# EAGLE design 10w_Driver (EAGLE 7.2.0)
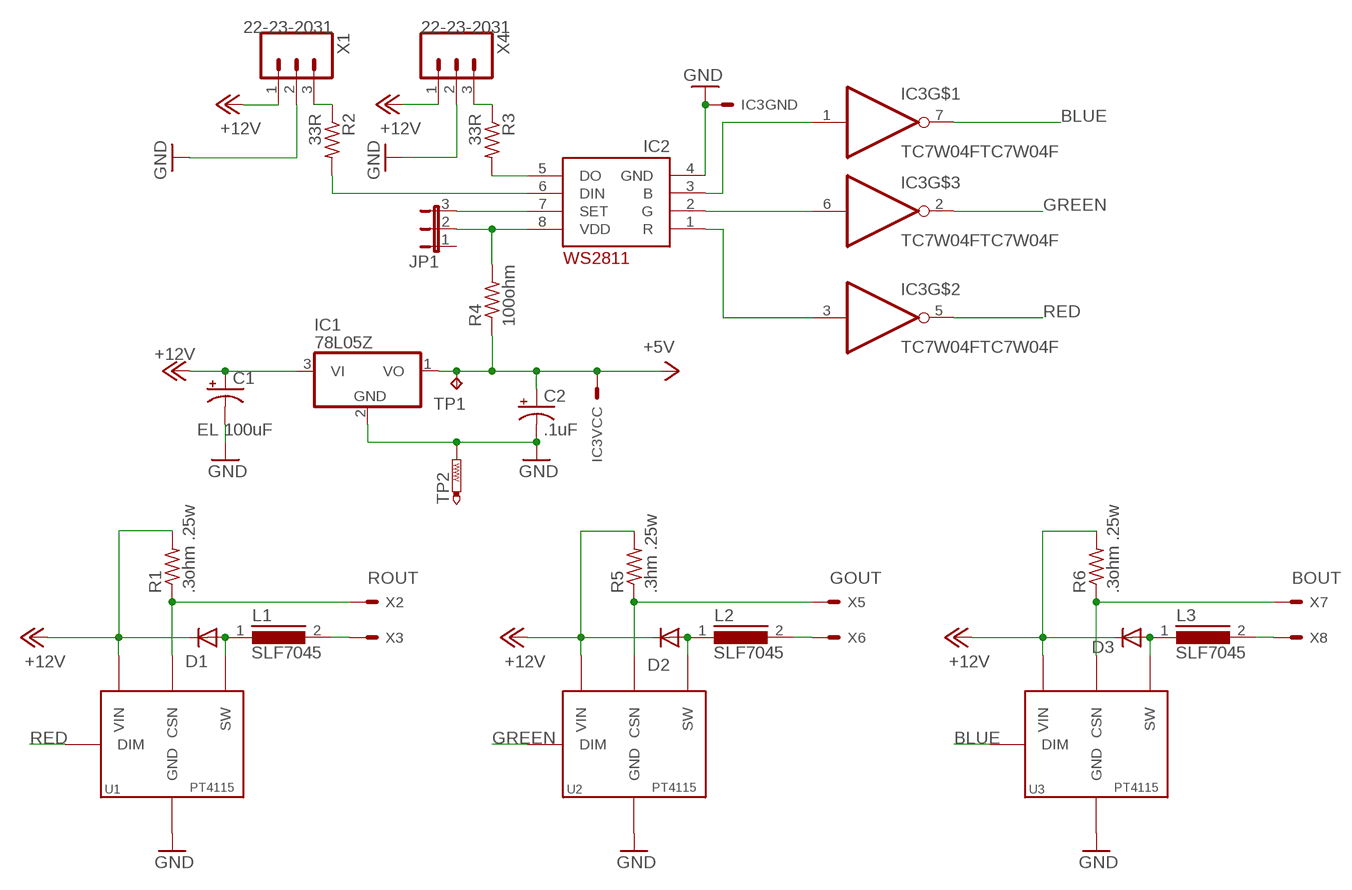
[diagram p0: schematic, sheet 1]

## Parts
C1  EL 100uF  CPOL-USTT2D6L  [TT2D6L]
C2  .1uF  CPOL-USB45181A  [B45181A]
D1  DIODE-DO07  [DO07]
D2  DIODE-DO07  [DO07]
D3  DIODE-DO07  [DO07]
IC1  78L05Z  [TO92]
IC2  WS2811-SOP8  [SO08-SKINNYPADS]
IC3  TC7W04FTC7W04F  [SO08]
JP1  JP2E  [JP2]
L1  SLF7045  [SLF7045]
L2  SLF7045  [SLF7045]
L3  SLF7045  [SLF7045]
R1  .3ohm .25w  R-US_R1206  [R1206]
R2  33R  R-US_M0805  [M0805]
R3  33R  R-US_M0805  [M0805]
R4  100ohm  R-US_M0805  [M0805]
R5  .3hm .25w  R-US_M1206  [M1206]
R6  .3ohm .25w  R-US_R1206  [R1206]
TP1  TPB2,54  [B2,54]
TP2  PTR1TP20SQ  [TP20SQ]
U1  PT4115PT4115B89E  [SOT89-5]
U2  PT4115PT4115B89E  [SOT89-5]
U3  PT4115PT4115B89E  [SOT89-5]
X1  22-23-2031  [22-23-2031]
X2  LED-PAD  [LED-PAD]
X3  LED-PAD  [LED-PAD]
X4  22-23-2031  [22-23-2031]
X5  LED-PAD  [LED-PAD]
X6  LED-PAD  [LED-PAD]
X7  LED-PAD  [LED-PAD]
X8  LED-PAD  [LED-PAD]

## Nets
+5V: C2.+ IC1.1(VO) IC3.8(VCC:S) R4.1 TP1.TP
+12V: C1.+ D1.C D2.C D3.C IC1.3(VI) R1.2 R5.2 R6.2 U1.5(VIN) U2.5(VIN) U3.5(VIN) X1.1 X4.1
BLUE: IC3.7(O) U3.3(DIM)
BOUT: R6.1 U3.4(CSN) X7.P$1@1(S) X7.P$1@2(S) X7.P$1@3(S)
GND: C1.- C2.- IC1.2(GND) IC2.4(GND) IC3.4(GND:S) TP2.TP U1.2(GND) U1.2A(GND) U1.2A@1(GND) U1.2A@2(GND) U1.2A@3(GND) U1.2A@4(GND) U2.2(GND) U2.2A(GND) U2.2A@1(GND) U2.2A@2(GND) U2.2A@3(GND) U2.2A@4(GND) U3.2(GND) U3.2A(GND) U3.2A@1(GND) U3.2A@2(GND) U3.2A@3(GND) U3.2A@4(GND) X1.2 X4.2
GOUT: R5.1 U2.4(CSN) X5.P$1@1(S) X5.P$1@2(S) X5.P$1@3(S)
GREEN: IC3.2(O) U2.3(DIM)
N$1: D1.A L1.1 U1.1(SW)
N$2: D3.A L3.1 U3.1(SW)
N$3: L1.2 X3.P$1@1(S) X3.P$1@2(S) X3.P$1@3(S)
N$4: R3.1 X4.3
N$5: D2.A L2.1 U2.1(SW)
N$6: R2.1 X1.3
N$7: IC2.5(DO) R3.2
N$8: IC2.6(DIN) R2.2
N$9: L2.2 X6.P$1@1(S) X6.P$1@2(S) X6.P$1@3(S)
N$10: L3.2 X8.P$1@1(S) X8.P$1@2(S) X8.P$1@3(S)
N$14: IC2.8(VDD) JP1.2 R4.2
N$15: IC2.1(R) IC3.3(I)
N$16: IC2.3(B) IC3.1(I)
N$18: IC2.7(SET) JP1.3
N$19: IC2.2(G) IC3.6(I)
RED: IC3.5(O) U1.3(DIM)
ROUT: R1.1 U1.4(CSN) X2.P$1@1(S) X2.P$1@2(S) X2.P$1@3(S)
Unconnected: JP1.1

## Library data of the parts
C1 = rcl:CPOL-US: POLARIZED CAPACITOR, American symbol
C2 = resistor:CPOL-US: POLARIZED CAPACITOR, American symbol
D1-D3 = diode:DIODE-: DIODE
IC1 = linear:78*: Positive VOLTAGE REGULATOR Source: http://cache.national.com/ds/LM/LM78L05.pdf http://www.fairchildsemi.com/ds/LM/LM7805.pdf
IC2 = MyLibrary:WS2811
IC3 = MyLibrary:TC7W04F
JP1 = jumper:JP2E: JUMPER
L1-L3 = inductors:SLF7045: SMD Inductors(Coils) For Power Line (Wound, Magnetic Shielded) Source: TDK, e531_slf7045.pdf
R1 R5 R6 = resistor:R-US_: RESISTOR, American symbol
R2-R4 = rcl:R-US_: RESISTOR, American symbol
TP1 = testpad:TP: Test pad
TP2 = testpad:PTR1: TEST PIN
U1-U3 = IC:PT4115: 30V, 1.2A Step-down High Brightness LED Driver with 5000:1 Dimming PDF: http://www.google.pl/url?sa=t&rct=j&q=PT4115&source=web&cd=1&ved=0CC4QFjAA&url=http%3A%2F%2Fwww.micro-bridge.com%2Fdata%2FCRpowtech%2FPT4115E.pdf&ei=9NbxUKXPJNSzhAem2oGoAQ&usg=AFQjCNEsPWIIWjIVjxpF5YN6SPR3coTTpw&bvm=bv.1357700187,d.d2k
X1 X4 = MyLibrary:22-23-2031: .100" (2.54mm) Center Header - 3 Pin; MF: MOLEX; MPN: 22-23-2031; OC_FARNELL: 1462950; OC_NEWARK: 30C0862
X2 X3 X5-X8 = MyLibrary:LED-PAD

## Board
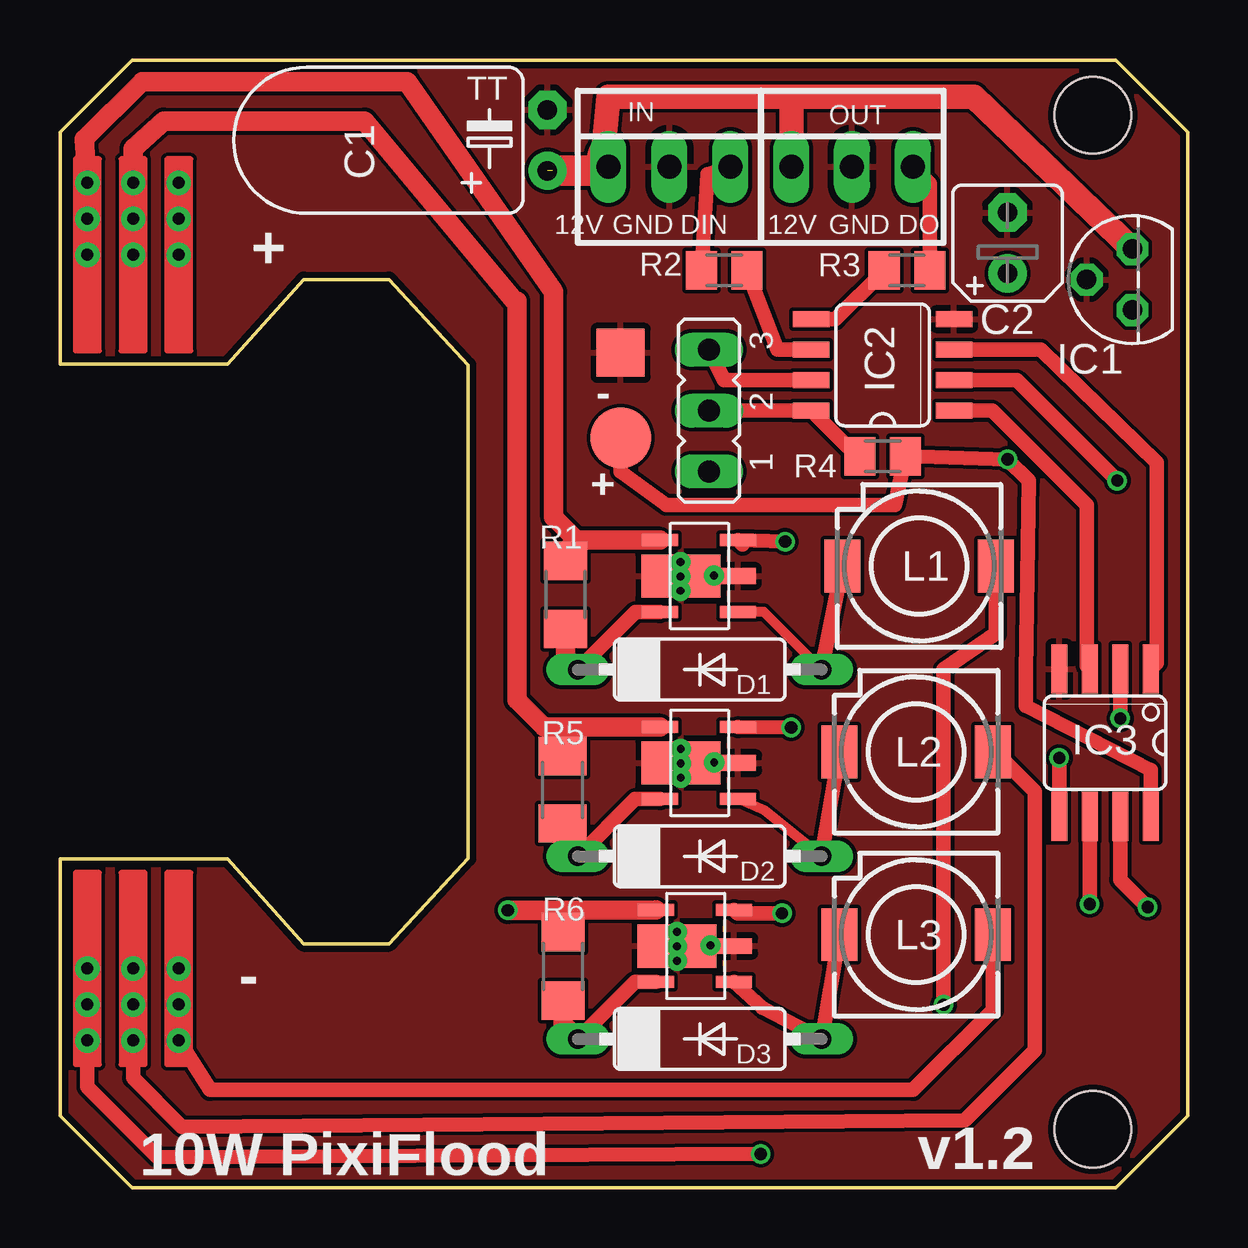
[diagram p1: board, top side]
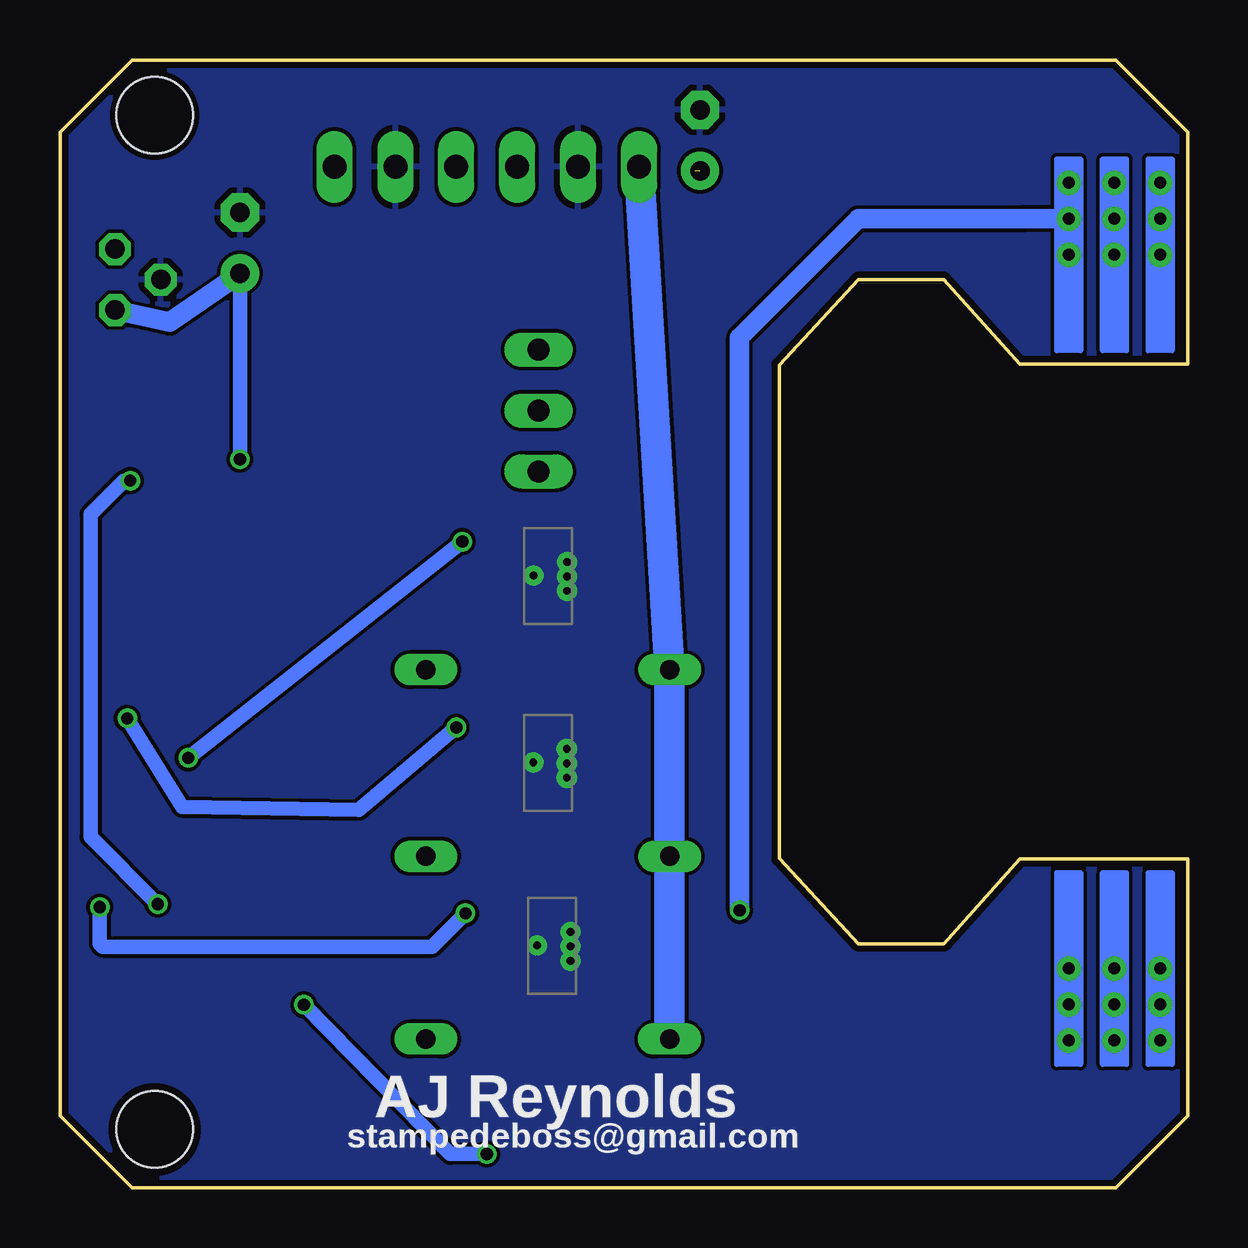
[diagram p2: board, bottom side, seen from below]

Size 47 x 47 mm. Coordinates in mm from the lower left corner, seen from the top.
Outline: 44,0 3,0 0,3 0,13.69 6.99,13.69 10.16,10.16 13.72,10.16 17.02,13.72 17.02,34.29 13.72,37.85 10.16,37.85 6.99,34.31 0,34.31 0,44 3,47 44,47 47,44 47,3 44,0
Copper layers (1*16): Top 0.035mm / dielectric 1.5mm / Bottom 0.035mm
Design rules "Elecrow_2-layer_eagle_rule": minimum track width 6mil, minimum drill 12mil, track to track 6mil, track to pad 6mil, pad to pad 6mil, via to via 6mil, smd to smd 0mil, copper to edge 10mil, drill to drill 10mil, minimum pad ring 10mil, minimum via ring 6mil, stop-mask expansion 2mil, vias tented up to drill 100mil, thermal gap 10mil
Holes 3.2 mm at 43.05,44.7 43.05,2.42
tRestrict: area 41.3,43 to 44.8,46.4; area 41.3,0.7 to 44.8,4.1
bRestrict: area 41.3,0.6 to 44.8,4.2; area 41.4,43.1 to 44.7,46.3
vRestrict: area 41.3,43 to 44.8,46.4; area 41.3,0.6 to 44.8,4.2

### Footprints (pad centres in the part's own frame; a part is rotated, then mirrored left to right if it is on the bottom)
TT2D6L = drill 0.813 pad 1.6: + -1.27,0 | drill 0.813 pad 1.6 octagon: - 1.27,0
B45181A = drill 0.813 pad 1.6: + -1.27,0 | drill 0.813 pad 1.6 octagon: - 1.27,0
DO07 = drill 0.813 long: A 5.08,0; C -5.08,0
TO92 = drill 0.813 octagon: 1 -1.27,0; 2 0,1.905; 3 1.27,0
SO08-SKINNYPADS = smd 0.66 x 1.524: 1 -1.905,-2.973; 2 -0.635,-2.973; 3 0.635,-2.973; 4 1.905,-2.973; 5 1.905,2.973; 6 0.635,2.973; 7 -0.635,2.973; 8 -1.905,2.973
SO08 = smd 0.66 x 2.032: 1 -1.905,-3.073; 2 -0.635,-3.073; 3 0.635,-3.073; 4 1.905,-3.073; 5 1.905,3.073; 6 0.635,3.073; 7 -0.635,3.073; 8 -1.905,3.073
JP2 = drill 0.914 long: 1 -2.54,0; 2 0,0; 3 2.54,0
SLF7045 = smd 1.5 x 2.2: 1 -3.2,0; 2 3.2,0
R1206 = smd 1.6 x 1.803: 1 -1.422,0; 2 1.422,0
M0805 = smd 1.3 x 1.6: 1 -0.95,0; 2 0.95,0
M1206 = smd 1.6 x 2: 1 -1.4,0; 2 1.4,0
B2,54 = smd 2.54 x 2.54: TP 0,0
TP20SQ = smd 2 x 2: TP 0,0
SOT89-5 = smd 0.5 x 1.5: 1 -1.587,-1.587; 3 1.413,-1.587; 4 1.413,1.663; 5 -1.587,1.663 | smd 0.65 x 1.5: 2 -0.087,-1.587 | smd 1.8 x 3.3: 2A -0.087,0.787 | drill 0.33 pad 0.33: 2A@1 -0.7,0.8; 2A@2 -0.1,0.8; 2A@3 0.5,0.8; 2A@4 -0.059,-0.597
22-23-2031 = drill 1 long: 1 -2.54,0; 2 0,0; 3 2.54,0
LED-PAD = drill 0.5 pad 0.61: P$1@1 0,1.492; P$1@2 0,-0.008; P$1@3 0,-1.508

### Placement (x,y rotation side)
C1  20.32,43.65 90 top
C2  39.5,39.37 90 top
D1  26.67,21.59 0 top
D2  26.67,13.81 0 top
D3  26.67,6.19 0 top
IC1  44.7,37.85 90 top
IC2  34.29,34.29 90 top
IC3  43.56,18.54 180 top
JP1  27.05,32.38 90 top
L1  35.81,25.91 0 top
L2  35.69,18.16 0 top
L3  35.69,10.54 0 top
R1  21.07,24.7 270 top
R2  27.69,38.23 0 top
R3  35.31,38.23 180 top
R4  34.29,30.48 180 top
R5  20.95,16.58 270 top
R6  20.97,9.22 270 top
TP1  23.37,31.24 0 top
TP2  23.37,34.8 0 top
U1  26.67,25.58 90 top
U2  26.67,17.78 90 top
U3  26.51,10.15 90 top
X1  25.4,42.55 0 top
X2  1.14,40.39 0 top
X3  1.14,7.62 180 top
X4  33.02,42.55 0 top
X5  3.05,40.39 0 top
X6  3.05,7.62 180 top
X7  4.95,40.39 0 top
X8  4.95,7.62 180 top

### Tracks (layer width: path | path; a pad name or v marks a point on that pad's centre or on a via)
+5V  (via drill 0.51)
  Top 0.61: IC3.8 45.47,17.4 40.26,20.07 40.26,21.46 40.39,29.46 v39.5,30.35 R4.1 34.8,28.45 25.27,28.45 23.37,29.84 TP1.TP
  Bottom 0.61: C2.+ v39.5,30.35
  Bottom 0.813: IC1.1 42.42,36.07 C2.+
+12V  (1 unrouted)
  Top 0.61: U3.5 23.96,8.56 D3.C | U2.5 23.98,16.2 D2.C | U1.5 23.99,23.99 D1.C
  Top 0.813: R1.2 21.07,22.11 D1.C | R5.2 20.95,14.45 D2.C | R6.2 20.97,6.82 D3.C
  Top 1.016: X1.1 22.63,43.08 22.86,45.47 30.48,45.47 | 30.48,45.47 X4.1 | 30.48,45.47 38.1,45.47 IC1.3
  Top 1.27: 20.54,42.38 21.93,42.38 arc90 22.63,43.08
  Bottom 1.27: D2.C D3.C | X1.1 D1.C | D1.C | D1.C D2.C | D2.C
BLUE  (via drill 0.51)
  Top 0.61: IC3.7 44.2,12.83 v45.34,11.68 | v30.1,11.43 28.23,11.43 U3.3
  Bottom 0.61: v45.34,11.68 45.34,10.16 45.21,10.03 31.5,10.03 v30.1,11.43
BOUT  (via drill 0.51)
  Top 0.61: X7.P$1@2 4.95,40.51
  Top 0.813: U3.4 20.32,11.56 | 20.32,11.56 v18.67,11.56 | R6.1 20.97,10.91 20.32,11.56
  Bottom 0.813: v18.67,11.56 18.67,35.43 13.72,40.38 6.93,40.38 6.86,40.38 X7.P$1@2 | X7.P$1@1 X7.P$1@2 | X7.P$1@2 X7.P$1@3
GND
  pour Bottom: 0,0 46.99,0 46.99,46.99 0,46.99
  pour Top: 0,0 46.99,0 46.99,46.99 0,46.99
GOUT
  Top 0.813: X5.P$1@3 X5.P$1@2 X5.P$1@1 3.05,43.31 4.32,44.45 12.7,44.45 19.05,36.83 | U2.4 20.32,19.2 | 20.32,19.2 20.17,19.2 19.05,20.32 19.05,36.83 | 19.05,36.83 19.05,36.95 | R5.1 20.95,18.56 20.32,19.2
GREEN  (via drill 0.51)
  Top 0.61: IC3.2 v44.2,19.56 | v30.48,19.18 U2.3
  Bottom 0.61: v44.2,19.56 41.91,15.88 34.54,15.75 v30.48,19.18
N$1
  Top 0.406: D1.A 29.34,23.99 U1.1
  Top 0.61: D1.A L1.1
N$2
  Top 0.61: U3.1 29.29,7.5 D3.A L3.1
N$3  (via drill 0.51)
  Top 0.61: L1.2 39.01,23.09 36.83,21.59 v36.83,7.62 | v29.21,1.4 4.06,1.27 1.14,4.19 X3.P$1@1
  Top 0.813: X3.P$1@1 X3.P$1@2 X3.P$1@3
  Bottom 0.61: v36.83,7.62 30.73,1.4 v29.21,1.4
N$4
  Top 0.61: X4.3 36.26,41.85 R3.1
N$5
  Top 0.406: D2.A 29.36,15.72 U2.1
  Top 0.61: D2.A L2.1
N$6
  Top 0.61: X1.3 26.98,42.23 R2.1
N$7
  Top 0.61: R3.2 32.32,36.2 IC2.5
N$8
  Top 0.61: R2.2 29.91,34.92 IC2.6
N$9
  Top 0.61: L2.2 38.99,18.16 40.64,16.51 40.64,5.71 37.72,2.79 5.08,2.54 3.05,4.57 X6.P$1@1
  Top 0.813: X6.P$1@1 X6.P$1@2 X6.P$1@3
N$10
  Top 0.61: X8.P$1@3 X8.P$1@2 X8.P$1@1 6.25,4.06 35.56,4.06 38.89,7.39 L3.2
N$14
  Top 0.61: JP1.2 IC2.8 33.22,30.48 R4.2
N$15
  Top 0.61: IC2.1 38.86,32.38 42.8,28.45 42.8,21.74 IC3.3
N$16
  Top 0.61: IC2.3 40.89,34.92 45.72,30.23 45.72,21.87 IC3.1
N$18
  Top 0.61: JP1.3 27.69,33.66 IC2.7
N$19  (via drill 0.51)
  Top 0.61: IC2.2 39.88,33.66 v44.07,29.46 | v42.93,11.81 IC3.6
  Bottom 0.61: v44.07,29.46 44.32,29.46 45.72,28.07 45.72,14.61 v42.93,11.81
RED  (via drill 0.51)
  Top 0.61: 28.45,26.8 U1.3 v30.23,26.92 | IC3.5 v41.66,17.91
  Bottom 0.61: v41.66,17.91 v30.23,26.92
ROUT
  Top 0.813: X2.P$1@3 X2.P$1@2 X2.P$1@1 1.02,43.69 3.43,46.1 14.48,46.1 20.57,37.34 20.57,27.94 21.52,26.99 | U1.4 21.52,26.99 | R1.1 21.07,26.53 21.52,26.99

### Text on the board
tPlace: IN | OUT | 12V | GND | DIN | 12V | GND | DO | + | - | + | - | v1.2 | 10W PixiFlood
bPlace: AJ Reynolds | stampedeboss@gmail.com